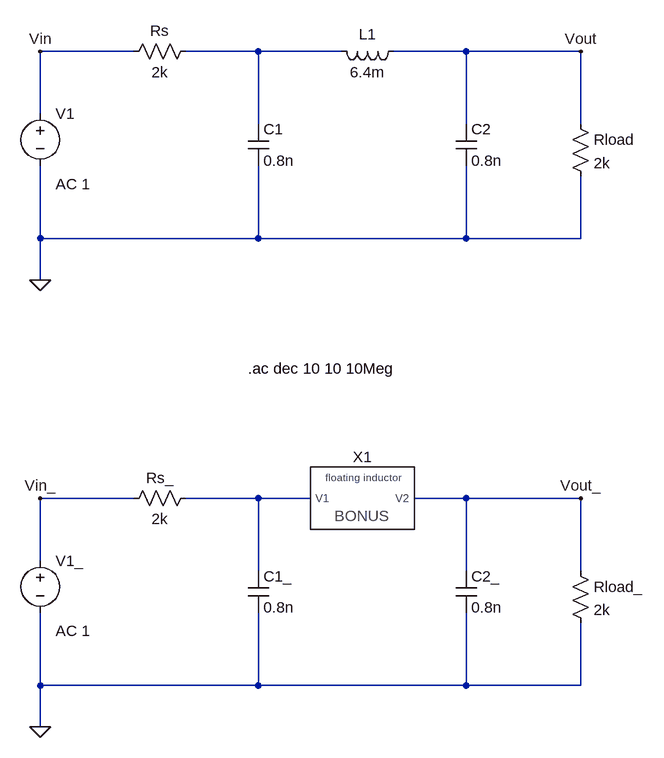
[diagram p0: schematic third_order_Butterworth_filter__bonus.asc]
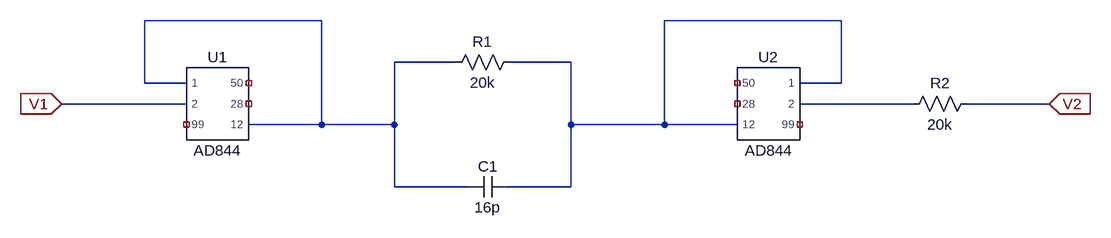
[diagram p1: sub-circuit floating_inductor__bonus.asc]
third_order_Butterworth_filter__bonus.asc, the LTspice schematic file:
Version 4
SHEET 1 1236 1144
WIRE 16 64 -128 64
WIRE 208 64 96 64
WIRE 336 64 208 64
WIRE 528 64 416 64
WIRE 704 64 528 64
WIRE -128 160 -128 64
WIRE 208 176 208 64
WIRE 528 176 528 64
WIRE 704 176 704 64
WIRE -128 352 -128 240
WIRE 208 352 208 240
WIRE 208 352 -128 352
WIRE 528 352 528 240
WIRE 528 352 208 352
WIRE 704 352 704 256
WIRE 704 352 528 352
WIRE -128 416 -128 352
WIRE 16 752 -128 752
WIRE 208 752 96 752
WIRE 288 752 208 752
WIRE 528 752 448 752
WIRE 704 752 528 752
WIRE -128 848 -128 752
WIRE 208 864 208 752
WIRE 528 864 528 752
WIRE 704 864 704 752
WIRE -128 1040 -128 928
WIRE 208 1040 208 928
WIRE 208 1040 -128 1040
WIRE 528 1040 528 928
WIRE 528 1040 208 1040
WIRE 704 1040 704 944
WIRE 704 1040 528 1040
WIRE -128 1104 -128 1040
FLAG -128 64 Vin
FLAG 704 64 Vout
FLAG -128 752 Vin_
FLAG 704 752 Vout_
FLAG -128 416 0
FLAG -128 1104 0
SYMBOL res 112 48 R90
WINDOW 0 0 56 VBottom 2
WINDOW 3 32 56 VTop 2
SYMATTR InstName Rs
SYMATTR Value 2k
SYMBOL ind 432 48 R90
WINDOW 0 5 56 VBottom 2
WINDOW 3 32 56 VTop 2
SYMATTR InstName L1
SYMATTR Value 6.4m
SYMBOL cap 192 176 R0
SYMATTR InstName C1
SYMATTR Value 0.8n
SYMBOL cap 512 176 R0
SYMATTR InstName C2
SYMATTR Value 0.8n
SYMBOL res 688 160 R0
SYMATTR InstName Rload
SYMATTR Value 2k
SYMBOL voltage -128 144 R0
WINDOW 123 24 124 Left 2
WINDOW 39 0 0 Left 0
SYMATTR Value2 AC 1
SYMATTR InstName V1
SYMATTR Value ""
SYMBOL res 112 736 R90
WINDOW 0 0 56 VBottom 2
WINDOW 3 32 56 VTop 2
SYMATTR InstName Rs_
SYMATTR Value 2k
SYMBOL cap 192 864 R0
SYMATTR InstName C1_
SYMATTR Value 0.8n
SYMBOL cap 512 864 R0
SYMATTR InstName C2_
SYMATTR Value 0.8n
SYMBOL res 688 848 R0
SYMATTR InstName Rload_
SYMATTR Value 2k
SYMBOL voltage -128 832 R0
WINDOW 123 24 124 Left 2
WINDOW 39 0 0 Left 0
SYMATTR Value2 AC 1
SYMATTR InstName V1_
SYMATTR Value ""
SYMBOL floating_inductor__bonus 368 752 R0
SYMATTR InstName X1
TEXT 192 552 Left 2 !.ac dec 10 10 10Meg

floating_inductor__bonus.asc, the sub-circuit schematic file:
Version 4
SHEET 1 880 680
WIRE -736 112 -1008 112
WIRE 64 112 -208 112
WIRE -528 176 -624 176
WIRE -352 176 -448 176
WIRE -1008 208 -1008 112
WIRE -944 208 -1008 208
WIRE 64 208 64 112
WIRE 64 208 0 208
WIRE -944 240 -1136 240
WIRE 176 240 0 240
WIRE 384 240 256 240
WIRE -736 272 -736 112
WIRE -736 272 -848 272
WIRE -624 272 -624 176
WIRE -624 272 -736 272
WIRE -352 272 -352 176
WIRE -208 272 -208 112
WIRE -208 272 -352 272
WIRE -96 272 -208 272
WIRE -624 368 -624 272
WIRE -512 368 -624 368
WIRE -352 368 -352 272
WIRE -352 368 -448 368
FLAG -1136 240 V1
IOPIN -1136 240 In
FLAG 384 240 V2
IOPIN 384 240 In
SYMBOL cap -448 352 R90
WINDOW 0 0 32 VBottom 2
WINDOW 3 32 32 VTop 2
SYMATTR InstName C1
SYMATTR Value 16p
SYMBOL res -432 160 R90
WINDOW 0 0 56 VBottom 2
WINDOW 3 32 56 VTop 2
SYMATTR InstName R1
SYMATTR Value 20k
SYMBOL res 272 224 R90
WINDOW 0 0 56 VBottom 2
WINDOW 3 32 56 VTop 2
SYMATTR InstName R2
SYMATTR Value 20k
SYMBOL AD844 -896 240 R0
SYMATTR InstName U1
SYMBOL AD844 -48 240 M0
SYMATTR InstName U2

The netlist it stands for:
* third_order_Butterworth_filter__bonus.asc
Rs N001 Vin 2k
L1 Vout N001 6.4m
C1 N001 0 0.8n
C2 Vout 0 0.8n
Rload Vout 0 2k
V1 Vin 0 AC 1
Rs_ N002 Vin_ 2k
C1_ N002 0 0.8n
C2_ Vout_ 0 0.8n
Rload_ Vout_ 0 2k
V1_ Vin_ 0 AC 1
XX1 N002 Vout_ floating_inductor__bonus

* block symbol definitions
.subckt floating_inductor__bonus V1 V2
C1 N002 N001 16p
R1 N002 N001 20k
R2 V2 N003 20k
XU1 N001 V1 NC_01 NC_02 NC_03 N001 AD844  ; pins 1 2 99 50 28 12
XU2 N002 N003 NC_04 NC_05 NC_06 N002 AD844  ; pins 1 2 99 50 28 12
.ends floating_inductor__bonus

.ac dec 10 10 10Meg
.lib C:\Users\Aras Güngöre\Documents\LTspiceXVII\Projeler\Proje 2 - Current Conveyor\ad844.cir
.backanno
.end